# EAGLE design learning_zumo (EAGLE 9.6.1)
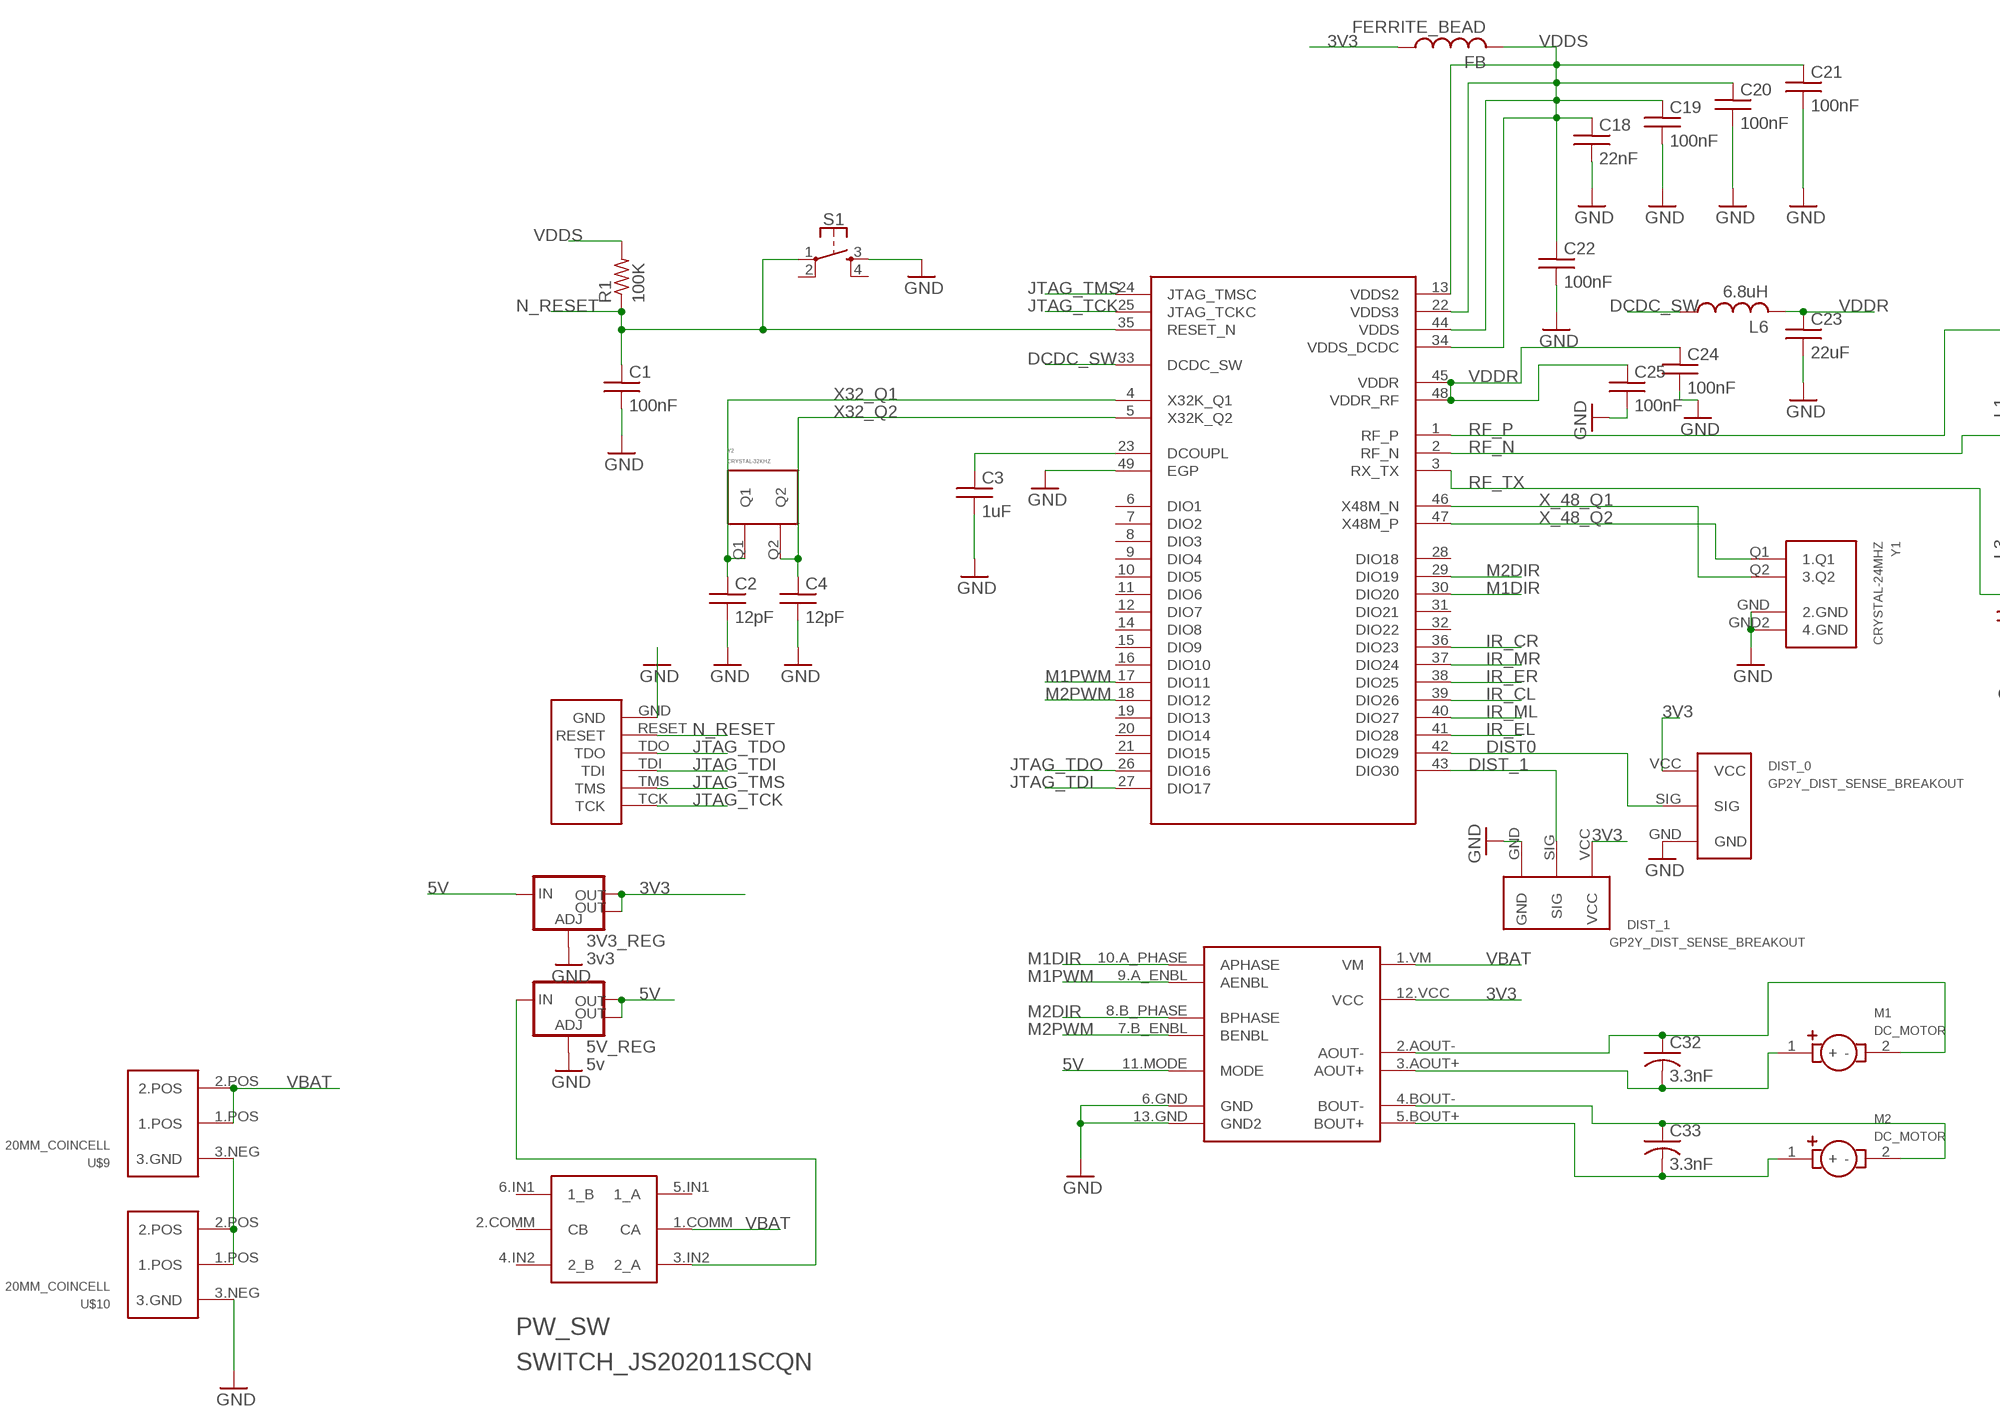
[diagram p0: schematic, sheet 1, part 1 of 2]
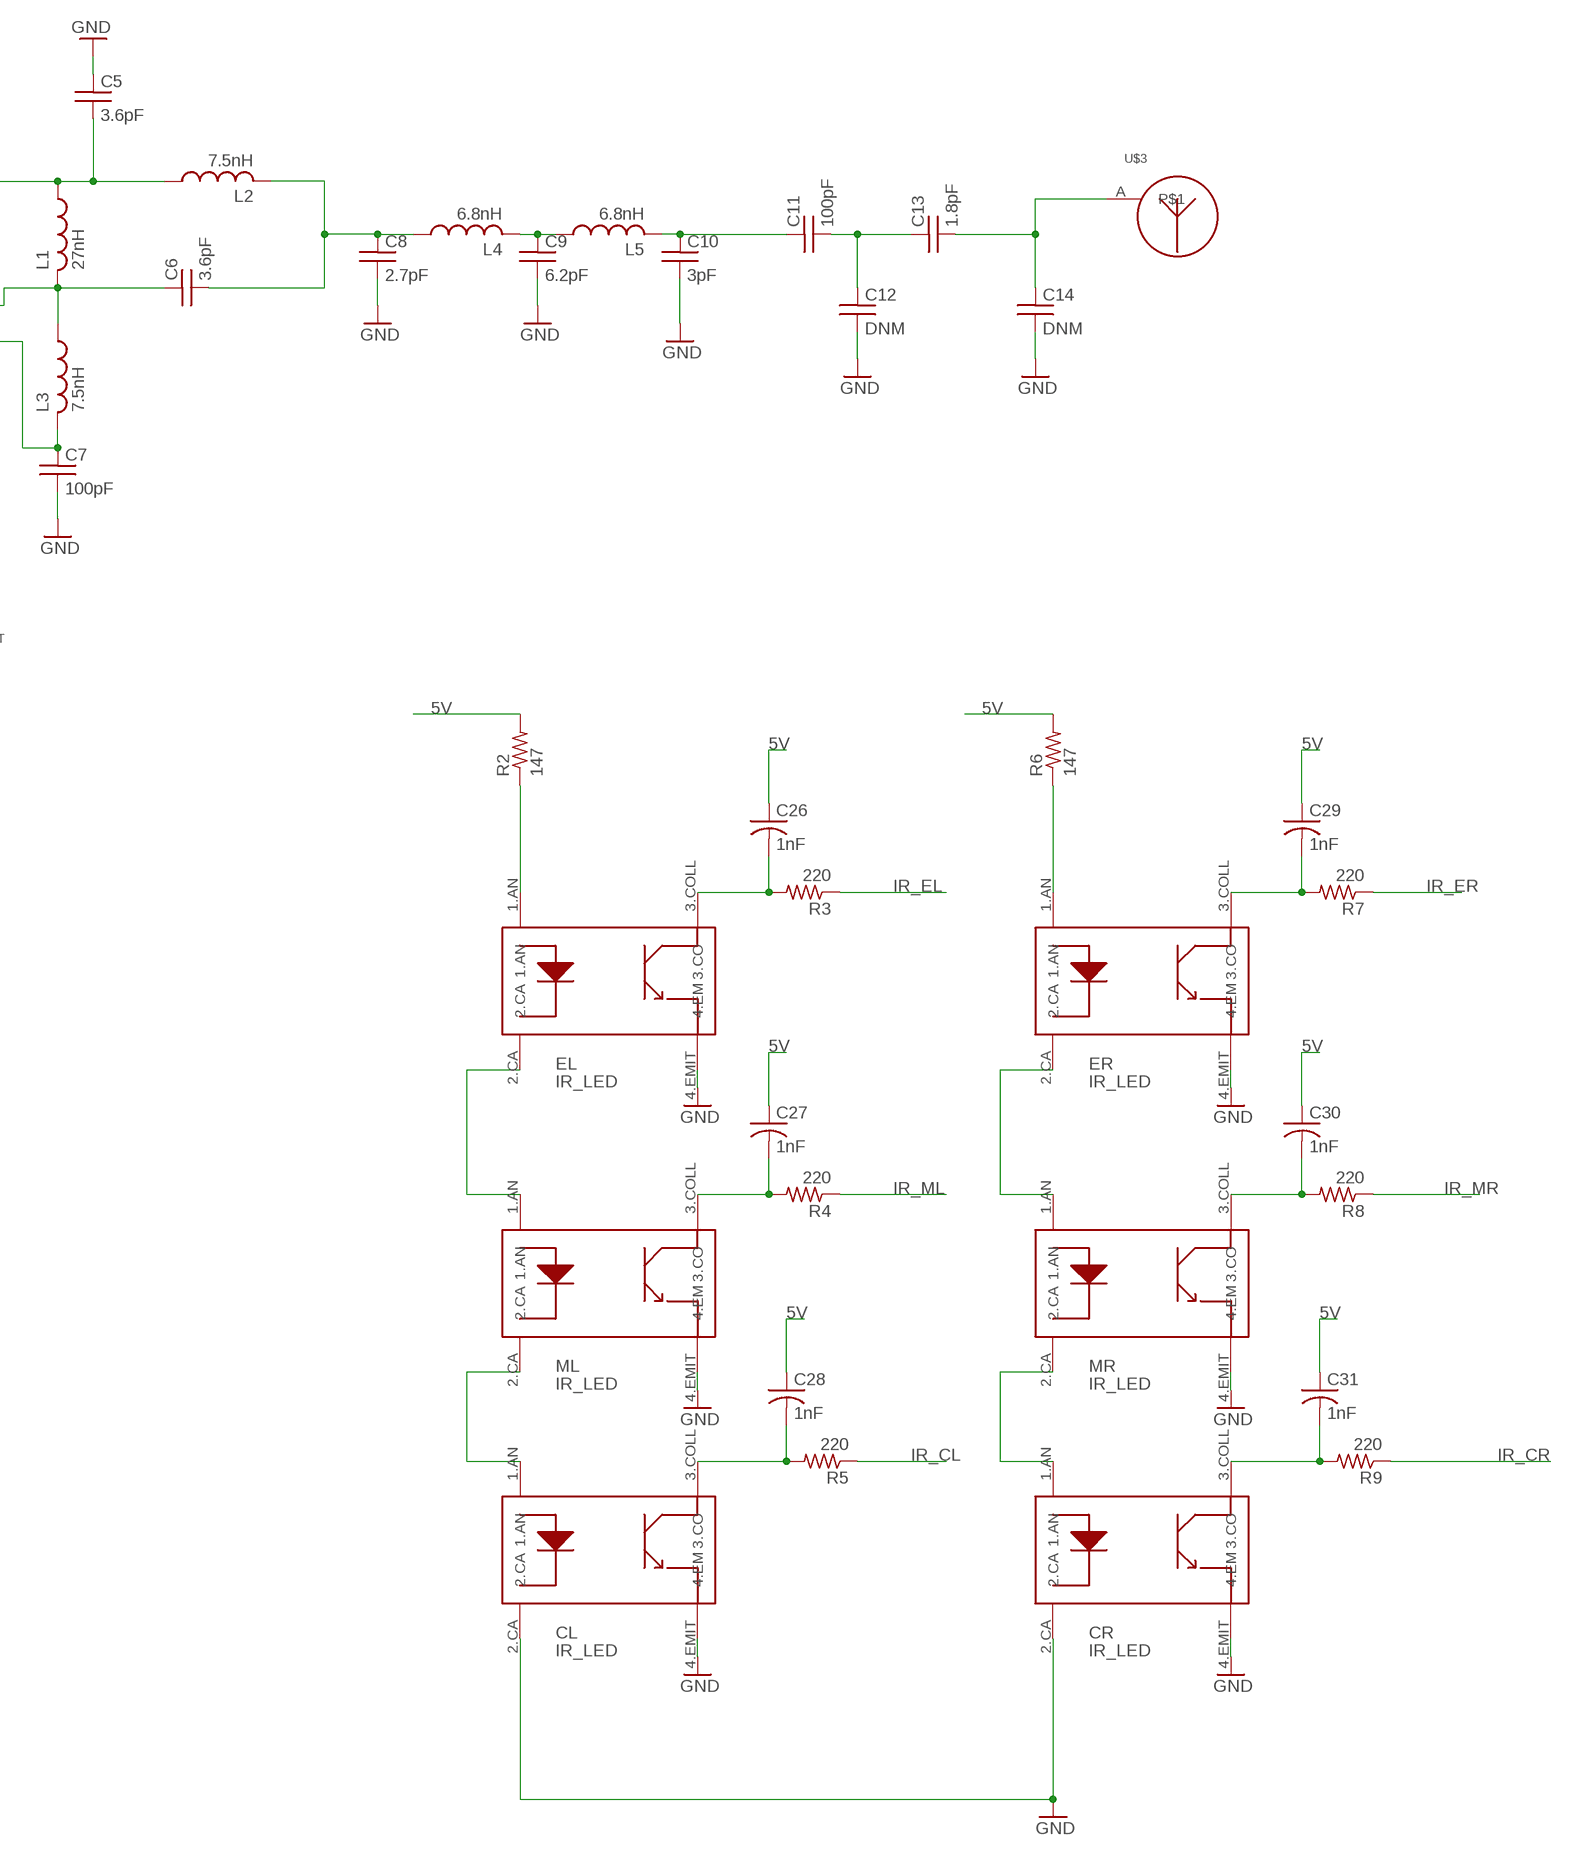
[diagram p1: schematic, sheet 1, part 2 of 2]

## Parts
3V3_REG  3v3  NU32V7_V_REG_LM1117SOT223  [NU32V7_SOT223]
5V_REG  5v  NU32V7_V_REG_LM1117SOT223  [NU32V7_SOT223]
C1  100nF  C-US  [C0402_US]
C2  12pF  C-US  [C0402_US]
C3  1uF  C-US  [C0402_US]
C4  12pF  C-US  [C0402_US]
C5  3.6pF  C-US  [C0402_US]
C6  3.6pF  C-US  [C0402_US]
C7  100pF  C-US  [C0402_US]
C8  2.7pF  C-US  [C0402_US]
C9  6.2pF  C-US  [C0402_US]
C10  3pF  C-US  [C0402_US]
C11  100pF  C-US  [C0402_US]
C12  DNM  C-US  [C0402_US]
C13  1.8pF  C-US  [C0402_US]
C14  DNM  C-US  [C0402_US]
C18  22nF  C-US  [C0402_US]
C19  100nF  C-US  [C0402_US]
C20  100nF  C-US  [C0402_US]
C21  100nF  C-US  [C0402_US]
C22  100nF  C-US  [C0402_US]
C23  22uF  C-US  [C0402_US]
C24  100nF  C-US  [C0402_US]
C25  100nF  C-US  [C0402_US]
C26  1nF  C-USC0805  [C0805]
C27  1nF  C-USC0805  [C0805]
C28  1nF  C-USC0805  [C0805]
C29  1nF  C-USC0805  [C0805]
C30  1nF  C-USC0805  [C0805]
C31  1nF  C-USC0805  [C0805]
C32  3.3nF  C-USC0805  [C0805]
C33  3.3nF  C-USC0805  [C0805]
CL  IR_LED  [IR_LED]
CR  IR_LED  [IR_LED]
DEBUG_HEADER  DEBUG_BREAKOUT  [DEBUG_BREAKOUT]
DIST_0  GP2Y_DIST_SENSE_BREAKOUT  [1X03]
DIST_1  GP2Y_DIST_SENSE_BREAKOUT  [1X03]
DRV8835  DRV8835DRV8835  [DRV8835]
EL  IR_LED  [IR_LED]
ER  IR_LED  [IR_LED]
FB  FERRITE_BEAD  [FERRITE_BEAD]
L1  27nH  L-US  [L0402_US]
L2  7.5nH  L-US  [L0402_US]
L3  7.5nH  L-US  [L0402_US]
L4  6.8nH  L-US  [L0402_US]
L5  6.8nH  L-US  [L0402_US]
L6  6.8uH  L-USL0805  [R0805]
M1  DC_MOTOR  [1X02]
M2  DC_MOTOR  [1X02]
ML  IR_LED  [IR_LED]
MR  IR_LED  [IR_LED]
PW_SW  SWITCH_JS202011SCQN  [SWITCH_JS202011SCQN]
R1  100K  R-US"  [R0402_US]
R2  147  R-US_R0805  [R0805]
R3  220  R-US_R0805  [R0805]
R4  220  R-US_R0805  [R0805]
R5  220  R-US_R0805  [R0805]
R6  147  R-US_R0805  [R0805]
R7  220  R-US_R0805  [R0805]
R8  220  R-US_R0805  [R0805]
R9  220  R-US_R0805  [R0805]
S1  MOMENTARY-SWITCH-SPST-2-SMD-4.6X2.8MM  [TACTILE_SWITCH_SMD_4.6X2.8MM]
U$1  CC1310  [QFN50P700X700X100-49N]
U$3  ANTENNA  [ANTENNA]
U$9  20MM_COINCELL  [20MM_COINCELL]
U$10  20MM_COINCELL  [20MM_COINCELL]
Y1  CRYSTAL-24MHZ  [CRYSTAL-24MHZ]
Y2  CRYSTAL-32KHZ  [CRYSTAL-32KHZ]

## Nets
3V3: 3V3_REG.OUTPUT(OUT) 3V3_REG.VOUT(OUT) DIST_0.VCC DIST_1.VCC DRV8835.12.VCC(VCC) FB.P$1
5V: 3V3_REG.INPUT(IN) 5V_REG.OUTPUT(OUT) 5V_REG.VOUT(OUT) C26.1 C27.1 C28.1 C29.1 C30.1 C31.1 DRV8835.11.MODE(MODE) R2.2 R6.2
DCDC_SW: L6.1 U$1.33(DCDC_SW)
DIST0: DIST_0.SIG U$1.42(DIO29)
DIST_1: DIST_1.SIG U$1.43(DIO30)
GND: 3V3_REG.GND(ADJ) 5V_REG.GND(ADJ) C1.2 C2.2 C3.2 C4.2 C5.1 C7.2 C8.2 C9.2 C10.2 C12.2 C14.2 C18.2 C19.2 C20.2 C21.2 C22.2 C23.2 C24.2 C25.2 CL.2.CA CL.4.EMIT(4.EM) CR.2.CA CR.4.EMIT(4.EM) DEBUG_HEADER.GND DIST_0.GND DIST_1.GND DRV8835.6.GND(GND) DRV8835.13.GND(GND2) EL.4.EMIT(4.EM) ER.4.EMIT(4.EM) ML.4.EMIT(4.EM) MR.4.EMIT(4.EM) S1.3 U$1.49(EGP) U$10.3.NEG(3.GND) Y1.GND2(4.GND) Y1.GND(2.GND)
IR_CL: R5.1 U$1.39(DIO26)
IR_CR: R9.1 U$1.36(DIO23)
IR_EL: R3.1 U$1.41(DIO28)
IR_ER: R7.1 U$1.38(DIO25)
IR_ML: R4.1 U$1.40(DIO27)
IR_MR: R8.1 U$1.37(DIO24)
JTAG_TCK: DEBUG_HEADER.TCK U$1.25(JTAG_TCKC)
JTAG_TDI: DEBUG_HEADER.TDI U$1.27(DIO17)
JTAG_TDO: DEBUG_HEADER.TDO U$1.26(DIO16)
JTAG_TMS: DEBUG_HEADER.TMS U$1.24(JTAG_TMSC)
M1DIR: DRV8835.10.A_PHASE(APHASE) U$1.30(DIO20)
M1PWM: DRV8835.9.A_ENBL(AENBL) U$1.17(DIO11)
M2DIR: DRV8835.8.B_PHASE(BPHASE) U$1.29(DIO19)
M2PWM: DRV8835.7.B_ENBL(BENBL) U$1.18(DIO12)
N$1: C3.1 U$1.23(DCOUPL)
N$2: C9.1 L4.P$2 L5.P$1
N$3: C10.1 C11.1 L5.P$2
N$4: 5V_REG.INPUT(IN) PW_SW.3.IN2(2_A)
N$5: U$9.3.NEG(3.GND) U$10.1.POS U$10.2.POS
N$6: C11.2 C12.1 C13.1
N$7: C13.2 C14.1 U$3.A
N$12: C6.2 C8.1 L2.P$2 L4.P$1
N$17: ER.1.AN R6.1
N$18: EL.1.AN R2.1
N$19: C26.2 EL.3.COLL(3.CO) R3.2
N$20: EL.2.CA ML.1.AN
N$21: CL.1.AN ML.2.CA
N$23: C27.2 ML.3.COLL(3.CO) R4.2
N$24: C33.2 DRV8835.5.BOUT+(BOUT+) M2.1(+)
N$25: C33.1 DRV8835.4.BOUT-(BOUT-) M2.2(-)
N$26: C32.2 DRV8835.3.AOUT+(AOUT+) M1.1(+)
N$27: C32.1 DRV8835.2.AOUT-(AOUT-) M1.2(-)
N$28: C28.2 CL.3.COLL(3.CO) R5.2
N$29: C29.2 ER.3.COLL(3.CO) R7.2
N$30: ER.2.CA MR.1.AN
N$31: CR.1.AN MR.2.CA
N$33: C30.2 MR.3.COLL(3.CO) R8.2
N$34: C31.2 CR.3.COLL(3.CO) R9.2
N_RESET: C1.1 DEBUG_HEADER.RESET R1.P$1 S1.1 U$1.35(RESET_N)
RF_N: C6.1 L1.P$2 L3.P$1 U$1.2(RF_N)
RF_P: C5.2 L1.P$1 L2.P$1 U$1.1(RF_P)
RF_TX: C7.1 L3.P$2 U$1.3(RX_TX)
VBAT: DRV8835.1.VM(VM) PW_SW.1.COMM(CA) U$9.1.POS U$9.2.POS
VDDR: C23.1 C24.1 C25.1 L6.2 U$1.45(VDDR) U$1.48(VDDR_RF)
VDDS: C18.1 C19.1 C20.1 C21.1 C22.1 FB.P$2 R1.P$2 U$1.13(VDDS2) U$1.22(VDDS3) U$1.34(VDDS_DCDC) U$1.44(VDDS)
X32_Q1: C2.1 U$1.4(X32K_Q1) Y2.Q1
X32_Q2: C4.1 U$1.5(X32K_Q2) Y2.Q2
X_48_Q1: U$1.46(X48M_N) Y1.Q2(3.Q2)
X_48_Q2: U$1.47(X48M_P) Y1.Q1(1.Q1)
Unconnected: PW_SW.2.COMM(CB) PW_SW.4.IN2(2_B) PW_SW.5.IN1(1_A) PW_SW.6.IN1(1_B) S1.2 S1.4 U$1.6(DIO1) U$1.7(DIO2) U$1.8(DIO3) U$1.9(DIO4) U$1.10(DIO5) U$1.11(DIO6) U$1.12(DIO7) U$1.14(DIO8) U$1.15(DIO9) U$1.16(DIO10) U$1.19(DIO13) U$1.20(DIO14) U$1.21(DIO15) U$1.28(DIO18) U$1.31(DIO21) U$1.32(DIO22)

## Library data of the parts
3V3_REG 5V_REG = Swarm:NU32V7_V_REG_LM1117: Voltage Regulator LM1117 Standard adjustable voltage regulator but in SMD form. Spark Fun Electronics SKU : COM-00595; PROD_ID: VREG-08170
C1-C14 C18-C25 = learning_particle:C-US
C26-C33 = Swarm:C-US: CAPACITOR, American symbol; SPICEPREFIX: C
CL CR EL ER ML MR = Swarm:IR_LED
DEBUG_HEADER = CC1310F128RGZ:DEBUG_BREAKOUT
DIST_0 DIST_1 = learning_particle:GP2Y_DIST_SENSE_BREAKOUT
DRV8835 = learning_particle:DRV8835
FB = CC1310F128RGZ:FERRITE_BEAD
L1-L6 = learning_particle:L-US
M1 M2 = learning_particle:DC_MOTOR
PW_SW = Swarm:SWITCH_JS202011SCQN
R1 = learning_particle:R-US
R2-R9 = Swarm:R-US_: RESISTOR, American symbol; SPICEPREFIX: R
S1 = Swarm:MOMENTARY-SWITCH-SPST-2: Momentary Switch (Pushbutton) - SPST - Two Circuits Normally-open (NO) SPST momentary switches (buttons, pushbuttons). Schematic symbol includes two switch circuits. Variants SMD-4.6MMX2.8MM - 4.60mm x 2.80mm Tactile Momentary Button Switch - Used on SparkFun SAMD21 Mini Breakout <https://www.sparkfun.com/products/13664> SMD-5.2MM - Mini Pushbutton Switch - SMD <https://www.sparkfun.com/products/8720> - Used on Arduino Pro Mini <https://www.sparkfun.com/products/11114>; PROD_ID: SWCH-13065
U$1 = learning_particle:CC1310
U$3 = learning_particle:ANTENNA
U$9 U$10 = learning_particle:20MM_COINCELL
Y1 = learning_particle:CRYSTAL-24MHZ
Y2 = learning_particle:CRYSTAL-32KHZ

## Board
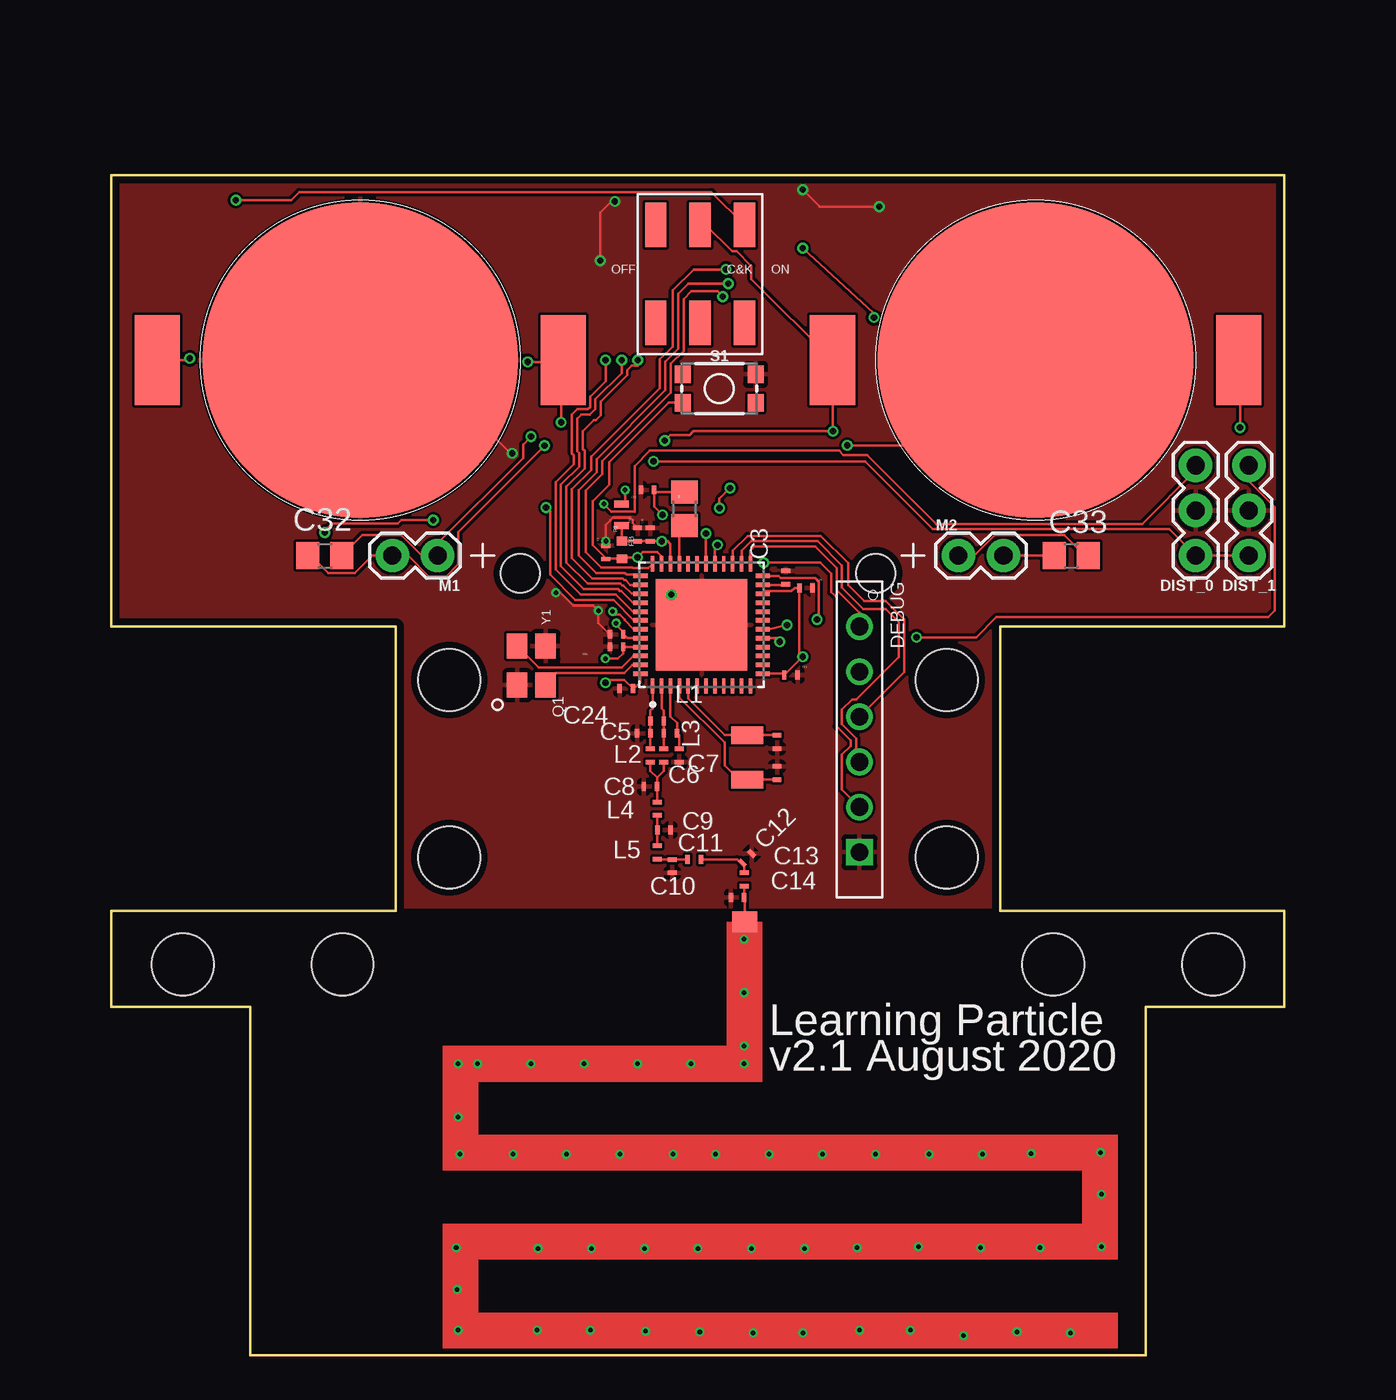
[diagram p2: board, top side]
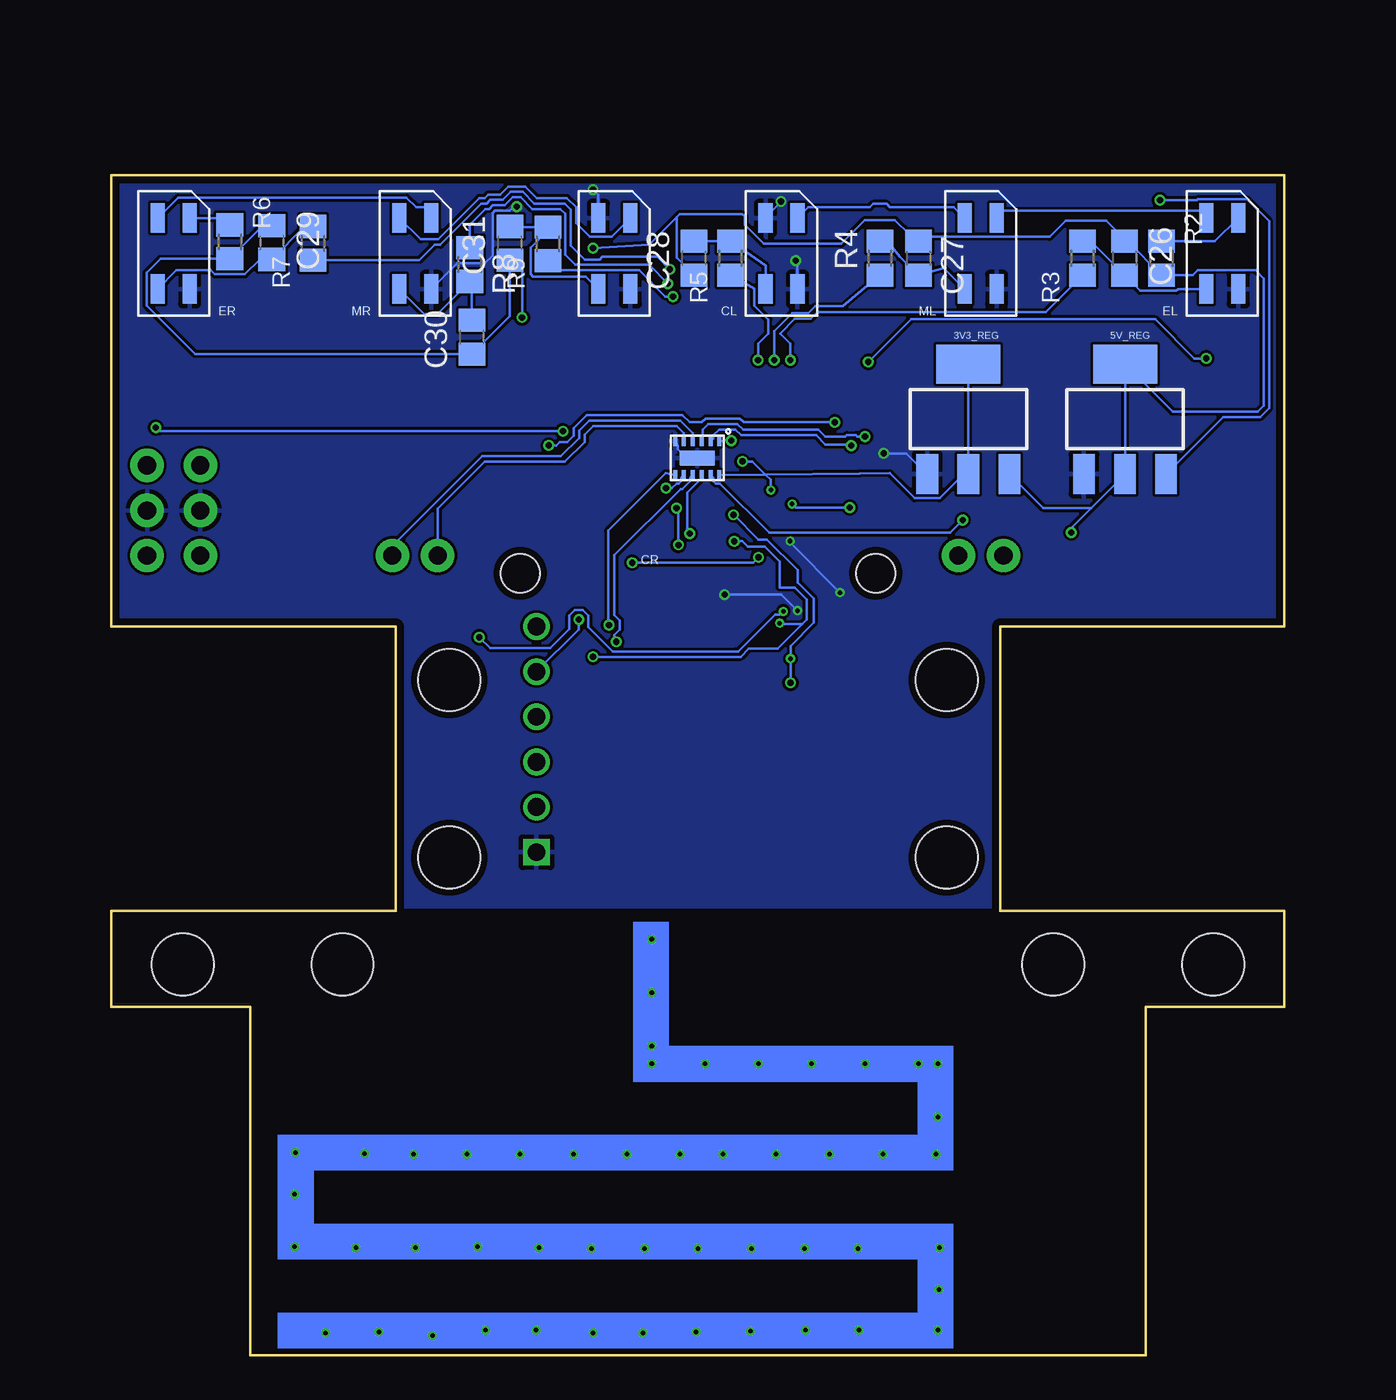
[diagram p3: board, bottom side, seen from below]

Size 66 x 66.4 mm. Coordinates in mm from the lower left corner, seen from the top.
Outline: 7.8,0 58.2,0 58.2,19.6 66,19.6 66,25 50,25 50,41 66,41 66,66.4 0,66.4 0,41 16,41 16,25 0,25 0,19.6 7.8,19.6 7.8,0
Copper layers (1*16): Top 0.035559375mm / dielectric 1.6mm / Bottom 0.035559375mm
Design rules "oshpark-2layer *": minimum track width 6mil, minimum drill 10mil, track to track 6mil, track to pad 6mil, pad to pad 6mil, via to via 6mil, smd to smd 0mil, copper to edge 15mil, drill to drill 6mil, minimum pad ring 5mil, minimum via ring 5mil, stop-mask expansion 2.5mil, vias tented up to drill 10mil, thermal gap 10mil
Holes 3.5 mm at 19,38 19,28 47,38 47,28 13,22 4,22 53,22 62,22
Holes 2.2 mm at 23,44 43,44

### Footprints (pad centres in the part's own frame; a part is rotated, then mirrored left to right if it is on the bottom)
NU32V7_SOT223 = smd 1.219 x 2.235: GND -2.311,-3.099; INPUT 2.311,-3.099; OUTPUT 0,-3.099 | smd 3.6 x 2.2: VOUT 0,3.099
C0402_US = smd 0.25 x 0.5: 1 -0.375,0; 2 0.375,0
C0805 = smd 1.3 x 1.5: 1 -0.95,0; 2 0.95,0
IR_LED = smd 0.79 x 1.66: 1.AN -0.9,-2; 2.CA 0.9,-2; 3.COLL 0.9,2; 4.EMIT -0.9,2
DEBUG_BREAKOUT = drill 1 square: GND 12.7,0 | drill 1: RESET 10.16,0; TCK 0,0; TDI 5.08,0; TDO 7.62,0; TMS 2.54,0
1X03 = drill 1.016 pad 1.88: GND 2.54,0; SIG 5.08,0; VCC 0,0
DRV8835 = smd 0.5 x 0.25: 1.VM -0.95,1.25; 2.AOUT- -0.95,0.75; 3.AOUT+ -0.95,0.25; 4.BOUT- -0.95,-0.25; 5.BOUT+ -0.95,-0.75; 6.GND -0.95,-1.25; 7.B_ENBL 0.95,-1.25; 8.B_PHASE 0.95,-0.75; 9.A_ENBL 0.95,-0.25; 10.A_PHASE 0.95,0.25; 11.MODE 0.95,0.75; 12.VCC 0.95,1.25 | smd 0.9 x 2: 13.GND 0,0
FERRITE_BEAD = smd 0.4 x 0.8: P$1 -0.6,0; P$2 0.6,0
L0402_US = smd 0.25 x 0.5: P$1 -0.375,0; P$2 0.375,0
R0805 = smd 1.3 x 1.5: 1 -0.95,0; 2 0.95,0
1X02 = drill 1.016 pad 1.88: 1 0,0; 2 2.54,0
SWITCH_JS202011SCQN = smd 1.2 x 2.5: 1.COMM 0,2.75; 2.COMM 0,-2.75; 3.IN2 2.5,2.75; 4.IN2 2.5,-2.75; 5.IN1 -2.5,2.75; 6.IN1 -2.5,-2.75
R0402_US = smd 0.5 x 0.6: P$1 -0.5,0; P$2 0.5,0
TACTILE_SWITCH_SMD_4.6X2.8MM = smd 0.9 x 1: 1 -2.05,-0.8; 2 2.05,-0.8; 3 2.05,0.8; 4 -2.05,0.8
QFN50P700X700X100-49N = smd 0.86 x 0.26: 1 -3.435,2.75; 2 -3.435,2.25; 3 -3.435,1.75; 4 -3.435,1.25; 5 -3.435,0.75; 6 -3.435,0.25; 7 -3.435,-0.25; 8 -3.435,-0.75; 9 -3.435,-1.25; 10 -3.435,-1.75; 11 -3.435,-2.25; 12 -3.435,-2.75; 25 3.435,-2.75; 26 3.435,-2.25; 27 3.435,-1.75; 28 3.435,-1.25; 29 3.435,-0.75; 30 3.435,-0.25; 31 3.435,0.25; 32 3.435,0.75; 33 3.435,1.25; 34 3.435,1.75; 35 3.435,2.25; 36 3.435,2.75 | smd 0.26 x 0.86: 13 -2.75,-3.435; 14 -2.25,-3.435; 15 -1.75,-3.435; 16 -1.25,-3.435; 17 -0.75,-3.435; 18 -0.25,-3.435; 19 0.25,-3.435; 20 0.75,-3.435; 21 1.25,-3.435; 22 1.75,-3.435; 23 2.25,-3.435; 24 2.75,-3.435; 37 2.75,3.435; 38 2.25,3.435; 39 1.75,3.435; 40 1.25,3.435; 41 0.75,3.435; 42 0.25,3.435; 43 -0.25,3.435; 44 -0.75,3.435; 45 -1.25,3.435; 46 -1.75,3.435; 47 -2.25,3.435; 48 -2.75,3.435 | smd 5.15 x 5.15: 49 0,0
ANTENNA = smd 1.4 x 1.15: A 1,1
20MM_COINCELL = smd 2.54 x 5.08: 1.POS -11.43,0; 2.POS 11.43,0 | smd 17.78 x 17.78: 3.NEG 0,0
CRYSTAL-24MHZ = smd 1.4 x 1.15: GND -1.1,1.1; GND2 1.1,-0.5; Q1 -1.1,-0.5; Q2 1.1,1.1
CRYSTAL-32KHZ = smd 1 x 1.8: Q1 1.25,0; Q2 -1.25,0

### Placement (x,y rotation side)
3V3_REG  17.79,52.68 0 bottom
5V_REG  8.97,52.68 0 bottom
C1  27.82,45.18 90 top
C2  37.45,32.77 90 top
C3  37.95,43.76 90 top
C4  37.45,34.51 270 top
C5  29.95,35 0 top
C6  31.07,33.75 270 top
C7  31.95,33.75 270 top
C8  30.32,32 180 top
C9  31.09,29.55 0 top
C10  31.55,27.52 270 top
C11  32.79,27.89 0 top
C12  35.76,27.97 45 top
C13  35.6,26.77 270 top
C14  35.23,25.75 180 top
C18  29.6,46.19 90 top
C19  28.42,40.57 180 top
C20  39.08,43.18 0 top
C21  38.23,38.28 0 top
C22  30.32,46.18 90 top
C23  30.16,48.7 180 top
C24  28.97,37.52 180 top
C25  28.42,39.87 180 top
C26  9,61.74 270 bottom
C27  20.6,61.74 270 bottom
C28  33.22,61.74 90 bottom
C29  56.98,62.62 270 bottom
C30  45.72,57.3 90 bottom
C31  43.58,62.58 90 bottom
C32  12,45 0 top
C33  54,45 0 top
CL  28.3,62 180 bottom
CR  37.7,62 180 bottom
DEBUG_HEADER  42.09,41.01 270 top
DIST_0  61,45 90 top
DIST_1  64,45 90 top
DRV8835  33.04,50.49 270 bottom
EL  3.5,62 180 bottom
ER  62.5,62 180 bottom
FB  28.7,47.3 270 top
L1  30.7,35.7 0 top
L2  30.32,33.75 270 top
L3  31.45,35 0 top
L4  30.7,30.75 270 top
L5  30.7,28.28 270 top
L6  32.25,47.63 90 top
M1  18.35,45 180 top
M2  47.65,45 0 top
ML  17.1,62 180 bottom
MR  48.9,62 180 bottom
PW_SW  33.12,60.85 0 top
R1  28.72,45.32 90 top
R2  6.92,61.74 270 bottom
R3  11.36,61.74 90 bottom
R4  22.76,61.74 90 bottom
R5  31.16,61.74 90 bottom
R6  59.34,62.66 270 bottom
R7  54.66,62.58 90 bottom
R8  45.84,61.38 270 bottom
R9  41.44,62.54 90 bottom
S1  34.2,54.4 0 top
U$1  33.2,41.1 90 top
U$3  36.63,25.39 180 top
U$9  52,56 180 top
U$10  14,56 0 top
Y1  23.93,38.81 90 top
Y2  35.76,33.64 270 top

### Tracks (layer width: path | path; a pad name or v marks a point on that pad's centre or on a via)
3V3  (via drill 0.25, 0.35)
  Top 0.152: v28.9,48.7 28.9,48.1 FB.P$1 | v30.5,50.3 42.4,50.3 46.22,46.48 59.52,46.48 DIST_0.VCC DIST_1.VCC
  Bottom 0.152: 3V3_REG.VOUT 3V3_REG.OUTPUT 18.05,49.58 19.4,48.23 20.81,48.23 22.21,49.64 23.9,49.62 29.2,49.57 | DRV8835.12.VCC 29.2,49.57 | 29.2,49.57 29.93,50.3 v30.5,50.3 | v28.9,48.7 28.9,49.27 29.2,49.57
5V  (via drill 0.35)
  Top 0.152: v18.1,47 16.3,47 16.1,46.8 12.4,46.8 12,46.4 v12,46.3 | v38.9,62.3 42.88,58.63 v42.9,58.4
  Bottom 0.152: 10.88,47.68 5V_REG.OUTPUT 5V_REG.VOUT 6.29,53.1 1.5,53.1 1.17,53.43 1.17,60.6 1.63,61.06 4.89,61.06 5.16,60.79 R2.2 8.82,62.69 C26.1 9,62.83 10.02,63.85 12.3,63.85 13.21,62.94 20.46,62.94 C27.1 21.11,63.08 21.91,63.89 23.61,63.89 24.95,62.55 29.3,62.55 30.38,63.63 30.38,64.09 30.52,64.23 34.02,64.23 34.2,64.06 | 10.88,47.68 12,46.55 v12,46.3 | v18.1,47 18.8,46.3 29,46.3 31.76,49.06 32,49.06 32.14,49.2 32.14,49.39 DRV8835.11.MODE | 34.2,64.06 34.2,61.77 C28.1 | v38.9,62.3 35.75,62.5 34.2,64.06 | v42.9,58.4 42.9,60.95 C31.1 43.58,58.49 C30.1 61.3,56.35 64.02,59.08 64.02,60.92 63.24,61.71 R6.2 57.48,63.57 C29.1 | 3V3_REG.INPUT 13.57,47.68 10.88,47.68
DCDC_SW
  Top 0.152: U$1.33 31.95,46.38 L6.1
DIST0  (via drill 0.25, 0.35)
  Top 0.152: U$1.42 29.4,41.35 28.25,42.5 26.1,42.5 24.68,43.92 24.68,47.47 v24.45,47.7 | v27.7,47.9 28.13,47.47 29.43,47.47 29.43,50.05 30.29,50.9 40.95,50.9 41.18,50.67 42.53,50.67 46.41,46.79 57.99,46.79 61,49.8 DIST_0.SIG
  Bottom 0.152: v24.45,47.7 27.5,47.7 v27.7,47.9
DIST_1  (via drill 0.25, 0.35)
  Top 0.152: DIST_1.SIG 64,49.19 65.47,47.73 65.47,41.9 65.1,41.53 49.78,41.53 48.65,40.4 v45.3,40.4 | v28.2,41.86 28.38,41.68 28.6,41.68 28.88,41.4 28.88,41.37 29.4,40.85 U$1.43
  Bottom 0.152: v45.3,40.4 44.7,39.8 41.3,39.8 40.23,40.87 40.23,41.62 39.92,41.93 39.48,41.93 39.17,41.62 39.17,40.97 37.8,39.6 30.9,39.6 30.8,39.6 30.73,39.6 28.65,41.68 28.38,41.68 v28.2,41.86
GND  (via drill 0.25, 0.35)
  Top 0.152: U$10.3.NEG 17.2,56 22.5,50.7 v22.55,50.75 | U$1.49 v31.5,42.8 | C19.2 27.4,41.22 v27.4,41.9 27.11,42.2 25.97,42.2 25.26,42.91 v25.01,42.91 | v27.5,61.6 27.5,64.3 28.3,65.1 28.33,65.07 v28.33,64.93 | v43.2,64.63 39.87,64.63 v38.9,65.6 | C1.2 v27.82,45.82 27.82,46.72 28.07,46.97 28.07,46.99 28.2,47.13 29.2,47.13 29.33,46.99 29.33,46.84 C18.2
  Bottom 0.152: v22.55,50.75 21.27,50.75 3V3_REG.GND | DRV8835.6.GND 34.14,51.19 34.14,51 33.63,50.49 DRV8835.13.GND | v31.5,42.8 28.3,42.8 v27.4,41.9 | CL.4.EMIT 27.4,61.5 v27.5,61.6 | v28.33,64.93 29.2,64.06 CL.2.CA | v43.2,64.63 43.37,64.63 43.59,64.41 44.42,64.41 44.56,64.28 44.56,61.89 44.99,61.45 46.55,61.45 MR.4.EMIT | v38.9,65.6 38.6,65.3 CR.2.CA | v25.01,42.91 27.82,45.72 v27.82,45.82
  pour Top: 0,25.2 66.06,25.2 67.1,26.24 67.1,66.1 65.6,67.6 0.8,67.6 -1.9,64.9 -1.9,27.1
  pour Bottom: 0.2,25.2 -0.25,25.65 -0.25,25.55 -1.9,27.2 -1.9,66 -0.1,67.8 66.5,67.8 66.8,67.5 66.8,25.8 66.2,25.2
IR_CL  (via drill 0.35)
  Top 0.152: v29.62,56 29.62,55.72 29.6,55.7 29.27,55.7 29.01,55.45 29.01,55.15 27.54,53.67 27.54,52.91 27.25,52.62 27.14,52.62 26.52,52 26.52,51 26.62,50.9 26.62,49.9 25.59,48.88 25.59,44.62 26.8,43.41 28.63,43.41 28.73,43.32 28.8,43.32 29.27,42.85 U$1.39
  Bottom 0.152: v29.62,56 29.62,56.92 29.04,57.5 29.04,58.29 29.82,59.08 29.82,60.03 R5.1
IR_CR  (via drill 0.35)
  Top 0.152: v34.4,59.58 34.1,59.88 32.62,59.88 32.19,59.45 32.19,56.52 31.47,55.8 31.47,54.18 27.61,50.32 27.61,49.57 26.7,48.67 26.7,45.2 27.57,44.33 29.31,44.33 29.35,44.29 30.21,44.29 U$1.36
  Bottom 0.152: v34.4,59.58 34.83,59.58 36.31,61.06 40.91,61.06 R9.1
IR_EL  (via drill 0.35)
  Top 0.152: v27.8,56 27.8,54.83 26.93,53.96 26.93,53.37 26.8,53.23 26.2,53.23 25.91,52.94 25.91,50.75 26.01,50.65 26.01,50.15 24.99,49.13 24.99,44.22 26.4,42.8 28.38,42.8 29.33,41.85 U$1.41
  Bottom 0.152: v27.8,56 27.8,56.92 28.38,57.5 27.55,58.33 26.66,58.33 26.29,58.7 13.43,58.7 R3.1
IR_ER  (via drill 0.35)
  Top 0.152: U$1.38 29.2,43.35 28.93,43.62 28.85,43.62 28.75,43.72 27.05,43.72 25.9,44.87 25.9,48.73 27,49.83 27,50.57 30.86,54.44 30.86,56.05 31.58,56.77 31.58,59.93 32.76,61.1 v34.58,61.1
  Bottom 0.152: R7.1 48.67,61.63 47.8,62.49 47.5,62.49 45.18,64.81 44.88,64.81 44.68,65.02 44,65.02 43.55,65.47 42.85,65.47 42.2,64.81 40.51,64.81 40.16,64.46 40.16,62.46 39.37,61.67 38.53,61.67 38.38,61.82 35.3,61.82 v34.58,61.1
IR_ML  (via drill 0.35)
  Top 0.152: v28.71,56 28.71,55.27 27.23,53.8 27.23,53.24 26.92,52.93 26.44,52.93 26.21,52.7 26.21,50.88 26.31,50.78 26.31,50.02 25.29,49 25.29,44.4 26.58,43.11 28.5,43.11 28.6,43.01 28.68,43.01 29.34,42.35 U$1.40
  Bottom 0.152: v28.71,56 28.71,57.64 27.71,58.64 26.78,58.64 26.39,59.03 24.84,59.03 R4.1
IR_MR  (via drill 0.35)
  Top 0.152: U$1.37 29.69,43.93 28.98,43.93 28.88,44.02 27.28,44.02 26.3,45 26.3,48.7 27.3,49.7 27.3,50.44 31.17,54.31 31.17,55.92 31.89,56.64 31.89,59.74 32.46,60.31 v34.7,60.31
  Bottom 0.152: R8.1 45.84,63.63 44.96,64.51 44.76,64.51 44.55,64.71 43.87,64.71 43.42,65.17 42.98,65.17 42.32,64.51 40.73,64.51 40.46,64.23 40.46,61.92 39.9,61.36 35.75,61.36 v34.7,60.31
JTAG_TCK
  Top 0.152: U$1.25 35.95,45.27 36.18,45.5 39.6,45.5 40.8,44.3 40.8,43.07 42.09,41.78 DEBUG_HEADER.TCK
JTAG_TDI
  Top 0.152: U$1.27 34.95,45.27 35.79,46.11 39.9,46.11 41.44,44.57 41.44,43.35 42.35,42.44 43.57,42.44 44.61,41.4 44.61,38.45 DEBUG_HEADER.TDI
JTAG_TDO
  Top 0.152: U$1.26 35.45,45.27 35.98,45.8 39.73,45.8 41.1,44.43 41.1,43.2 42.3,42 43.58,42 44.3,41.27 44.3,39.3 41.92,36.91 41.68,36.91 41.1,36.33 41.1,35.52 41.91,34.71 41.91,34.17 41.61,33.87 DEBUG_HEADER.TDO
JTAG_TMS  (via drill 0.35)
  Top 0.152: U$1.24 37.54,43.85 37.65,43.74 39.59,43.74 39.81,43.52 39.81,41.51 v39.7,41.4
  Bottom 0.152: v39.7,41.4 39.7,40.85 DEBUG_HEADER.TMS
M1DIR  (via drill 0.35)
  Top 0.152: v33.46,46.24 v33.45,46.23 U$1.30
  Bottom 0.152: v33.46,46.24 33.6,46.38 33.6,48.54 32.79,49.35 DRV8835.10.A_PHASE
M1PWM  (via drill 0.35)
  Top 0.152: U$1.17 37.39,40.35 v37.6,40.15
  Bottom 0.152: v37.6,40.15 37.71,40.26 37.71,40.53 37.4,40.84 37.4,41.34 37.71,41.65 37.71,45.03 33.98,48.76 33.88,48.76 33.44,49.2 33.44,49.39 DRV8835.9.A_ENBL
M2DIR  (via drill 0.35)
  Top 0.152: v34.1,45.6 33.95,45.45 U$1.29 | v34.21,47.67 34.21,48.21 v34.8,48.8
  Bottom 0.152: v34.1,45.6 34.1,47.57 v34.21,47.67 | DRV8835.8.B_PHASE 33.94,49.39 33.94,49.2 34.08,49.06 34.2,49.06 34.46,48.8 v34.8,48.8
M2PWM  (via drill 0.35)
  Top 0.152: U$1.18 36.69,40.79 v38.01,41.09
  Bottom 0.152: DRV8835.7.B_ENBL 34.81,49.64 38.05,46.41 38.05,41.14 v38.01,41.09
N$1
  Top 0.152: U$1.23 37.91,43.35 C3.1
N$2
  Top 0.152: L4.P$2 30.7,29.57 C9.1 L5.P$1
N$3
  Top 0.152: L5.P$2 31.54,27.91 C10.1 C11.1
N$4  (via drill 0.35)
  Top 0.152: v7,65 10.1,65 10.56,65.46 33.76,65.46 PW_SW.3.IN2
  Bottom 0.152: 5V_REG.INPUT 3.44,52.8 1.37,52.8 0.86,53.3 0.86,63.81 2.11,65.06 4.89,65.06 4.95,65 v7,65
N$5  (via drill 0.35)
  Top 0.152: v25.3,52.5 25.3,55.2 25.43,55.33 25.43,55.8 | 25.43,55.8 U$10.2.POS | U$9.3.NEG 51.9,55.9 51.1,55.9 46.4,51.2 v41.4,51.2 | U$10.1.POS 4.4,56 v4.4,56.1 | v23.42,55.9 25.33,55.9 25.43,55.8
  Bottom 0.152: v4.4,56.1 5.07,56.1 7.28,58.31 21.01,58.31 v23.42,55.9 | v25.3,52.5 30.44,52.5 30.65,52.71 32.56,52.71 32.77,52.5 33.46,52.5 33.87,52.91 39.25,52.91 39.99,52.17 39.99,51.75 40.35,51.39 40.77,51.39 40.96,51.2 v41.4,51.2
N$6
  Top 0.152: C11.2 35.2,27.9 35.4,27.7 C12.1 35.61,27.59 C13.1
N$7
  Top 0.152: C13.2 C14.1 35.63,25.72 35.63,24.62 U$3.A
N$8  (via drill 0.25)
  other vias: 35.6,23.4
N$10  (via drill 0.25)
  other vias: 35.6,17.4
N$11  (via drill 0.25)
  other vias: 35.6,20.4
N$12
  Top 0.152: L2.P$2 30.32,32.88 30.7,32.5 | 30.7,32.5 C8.1 L4.P$1 | C6.2 31.07,32.88 30.7,32.5
N$13  (via drill 0.25)
  other vias: 23.6,16.4
N$14  (via drill 0.25)
  other vias: 35.6,16.4
N$15  (via drill 0.25)
  other vias: 32.6,16.4
N$16  (via drill 0.25)
  other vias: 29.6,16.4
N$17
  Bottom 0.152: ER.1.AN 59.73,64 R6.1
N$18
  Bottom 0.152: EL.1.AN 3.91,62.69 R2.1
N$19
  Bottom 0.152: R3.2 10.9,62.69 C26.2 8.12,59.91 6.08,59.91 5.99,60 EL.3.COLL
N$20
  Bottom 0.152: EL.2.CA 4.8,64.4 15.8,64.4 ML.1.AN
N$21
  Bottom 0.152: ML.2.CA 18.6,64.6 22.2,64.6 22.39,64.79 23.13,64.79 23.32,64.6 26.8,64.6 CL.1.AN
N$22  (via drill 0.25)
  other vias: 26.6,16.4
N$23
  Bottom 0.152: ML.3.COLL 19.18,61.18 C27.2 21.64,61.83 22.53,62.91 R4.2
N$24
  Top 0.152: M2.1 48.54,45 49.71,46.17 53.6,46.17 54.77,45 C33.2
  Bottom 0.152: DRV8835.5.BOUT+ 33.79,51.9 34.2,52.3 38.9,52.3 39.38,51.82 39.38,51.4 40.5,50.28 45,50.28 47.65,47.63 M2.1
N$25
  Top 0.152: M2.2 C33.1
  Bottom 0.152: DRV8835.4.BOUT- 33.29,51.9 34,52.6 39.13,52.6 39.69,52.04 39.69,51.62 40.72,50.59 45.13,50.59 50.19,45.52 M2.2
N$26  (via drill 0.35)
  Top 0.152: v23.6,51.7 23.16,51.26 23.16,50.5 18.35,45.69 M1.1 17.46,45 16.29,46.17 14.12,46.17 C32.2
  Bottom 0.152: DRV8835.3.AOUT+ 32.74,51.45 32.74,52.1 32.43,52.41 30.78,52.41 30.45,52.08 26.22,52.08 25.84,51.7 24.71,51.7 24.62,51.79 24.12,51.79 24.03,51.7 v23.6,51.7
N$27  (via drill 0.35)
  Top 0.152: v24.37,51.19 19.52,46.33 19.52,44.52 18.83,43.83 17.87,43.83 16.7,45 M1.2 14.67,45 13.7,44.02 12.21,44.02 11.23,45 C32.1
  Bottom 0.152: DRV8835.2.AOUT- 32.14,51.58 32.14,51.78 31.82,52.1 30.91,52.1 30.58,51.78 26.34,51.78 25.83,51.26 24.5,51.26 24.43,51.19 v24.37,51.19
N$28
  Bottom 0.152: CL.3.COLL 29.2,61.33 R5.2 C28.2
N$29
  Bottom 0.152: ER.3.COLL 62.34,61.06 60.41,61.06 60.19,60.83 58.49,60.83 57.66,61.67 C29.2 55.12,63.53 R7.2
N$30
  Bottom 0.152: ER.2.CA 62.24,65.16 49.41,65.16 48.85,64.6 48.2,64.6 48,64.4 MR.1.AN
N$31
  Bottom 0.152: CR.1.AN 37.86,62.94 39.09,62.94 39.85,63.7 39.85,64.6 40.37,65.12 42.07,65.12 42.73,65.78 43.67,65.78 44.12,65.32 44.8,65.32 45.01,65.12 45.31,65.12 47.62,62.8 48.6,62.8 MR.2.CA
N$32  (via drill 0.25)
  other vias: 49,11.3
N$33
  Bottom 0.152: C30.2 45.72,60.31 R8.2 47.67,58.6 48.4,58.6 MR.3.COLL
N$34
  Bottom 0.152: C31.2 43.54,63.49 R9.2 41.44,63.31 42.42,62.34 42.42,60.84 42.28,60.71 39.31,60.71 CR.3.COLL
N$35  (via drill 0.25)
  other vias: 20.6,16.4
N$36  (via drill 0.25)
  other vias: 19.5,16.4
N$37  (via drill 0.25)
  other vias: 19.5,13.4
N$38  (via drill 0.25)
  other vias: 19.6,11.3
N$39  (via drill 0.25)
  other vias: 22.6,11.3
N$40  (via drill 0.25)
  other vias: 25.6,11.3
N$41  (via drill 0.25)
  other vias: 28.6,11.3
N$42  (via drill 0.25)
  other vias: 51.75,11.35
N$43  (via drill 0.25)
  other vias: 55.65,11.4
N$44  (via drill 0.25)
  other vias: 55.7,9.05
N$45  (via drill 0.25)
  other vias: 55.7,6.1
N$46  (via drill 0.25)
  other vias: 52.25,6.05
N$47  (via drill 0.25)
  other vias: 48.9,6.05
N$48  (via drill 0.25)
  other vias: 45.4,6.1
N$49  (via drill 0.25)
  other vias: 41.95,6.05
N$50  (via drill 0.25)
  other vias: 39,6
N$51  (via drill 0.25)
  other vias: 36,6
N$52  (via drill 0.25)
  other vias: 33,6
N$53  (via drill 0.25)
  other vias: 30,6
N$54  (via drill 0.25)
  other vias: 27,6
N$55  (via drill 0.25)
  other vias: 24,6
N$57  (via drill 0.25)
  other vias: 19.4,6.05
N$58  (via drill 0.25)
  other vias: 19.45,3.7
N$59  (via drill 0.25)
  other vias: 19.5,1.4
N$61  (via drill 0.25)
  other vias: 23.95,1.4
N$62  (via drill 0.25)
  other vias: 26.95,1.4
N$63  (via drill 0.25)
  other vias: 30.05,1.35
N$64  (via drill 0.25)
  other vias: 33.1,1.3
N$65  (via drill 0.25)
  other vias: 36.1,1.25
N$66  (via drill 0.25)
  other vias: 38.9,1.25
N$67  (via drill 0.25)
  other vias: 42.1,1.4
N$68  (via drill 0.25)
  other vias: 44.95,1.4
N$69  (via drill 0.25)
  other vias: 47.95,1.1
N$70  (via drill 0.25)
  other vias: 50.95,1.3
N$71  (via drill 0.25)
  other vias: 53.95,1.25
N$72  (via drill 0.25)
  other vias: 31.6,11.3
N$73  (via drill 0.25)
  other vias: 37,11.3
N$74  (via drill 0.25)
  other vias: 34,11.3
N$75  (via drill 0.25)
  other vias: 40,11.3
N$76  (via drill 0.25)
  other vias: 43,11.3
N$77  (via drill 0.25)
  other vias: 46,11.3
N_RESET  (via drill 0.35)
  Top 0.152: U$1.35 30.95,44.95 30.7,45.2 29.9,45.2 v29.6,44.9 28.8,44.9 R1.P$1 27.84,44.82 C1.1 27.82,44.86 27.07,45.6 27.07,48.07 28,49 28,50.25 31.35,53.6 S1.1 | DEBUG_HEADER.RESET 41.1,31.83 41.1,33.79 41.61,34.3 41.61,34.59 40.8,35.39 40.8,42.64 40.49,42.95 40.49,43.99 39.88,44.6 v36.7,44.6
  Bottom 0.152: v36.7,44.6 29.9,44.6 v29.6,44.9
RF_N
  Top 0.152: C6.1 L3.P$1 L1.P$2 31.07,36.27 30.95,36.4 U$1.2
RF_P
  Top 0.152: L2.P$1 C5.2 L1.P$1 30.32,36.27 30.45,36.4 U$1.1
RF_TX
  Top 0.152: U$1.3 31.45,35.95 31.82,35.58 L3.P$2 31.95,34.88 C7.1
VBAT  (via drill 0.35)
  Top 0.152: v63.5,52.2 63.5,55.93 U$9.1.POS | v31.13,51.47 31.45,51.8 32.53,51.8 32.73,52 v40.6,52 40.57,52.03 U$9.2.POS 36,60.57 36,61.3 35.18,62.12 34.92,62.12 33.45,63.6 PW_SW.1.COMM
  Bottom 0.152: v40.6,52 63.3,52 v63.5,52.2 | DRV8835.1.VM 31.59,51.44 31.51,51.5 31.16,51.5 v31.13,51.47
VDDR  (via drill 0.25, 0.35)
  Top 0.152: U$1.48 29.77,37.87 29.42,37.52 C24.1 28.86,38 27.95,38 v27.79,37.84 | U$1.45 28.82,39.85 C25.1 28.8,39.49 28.5,39.2 v27.79,39.2 | v31,47.3 30.54,47.77 C23.1 30.66,48.58 L6.2
  Bottom 0.152: v31,47.3 29.61,45.91 29.12,45.91 27.39,44.18 27.39,43.48 26.49,42.58 26.49,41.22 27.79,39.92 v27.79,39.2 v27.79,37.84
VDDS  (via drill 0.25, 0.35)
  Top 0.152: v28.4,41.2 28.4,41.1 28.8,40.7 C19.1 29.02,40.35 U$1.44 | U$1.34 31.45,45.65 31.29,45.81 v30.96,45.81 v30.95,45.82 30.34,45.82 C22.1 C18.1 R1.P$2 28.7,45.84 FB.P$2 | U$1.22 36.78,42.99 38.26,42.99 38.44,43.18 C20.1 38.7,39.49 v38.9,39.3 38.88,39.3 C21.1 37.78,38.35 U$1.13
  Bottom 0.152: v38.9,39.3 30.6,39.3 30.13,39.77 28.5,39.77 27.13,41.14 | 27.13,41.14 26.87,41.4 26.87,42.53 27.55,43.21 28.4,43.21 28.4,44.66 29.25,45.51 30.21,45.51 30.51,45.81 v30.96,45.81 | v28.4,41.2 28.34,41.14 27.13,41.14
X32_Q1
  Top 0.152: U$1.4 31.95,37.02 34.5,34.47 34.5,33.2 35.31,32.39 Y2.Q1 C2.1
X32_Q2
  Top 0.152: U$1.5 32.45,36.95 34.51,34.89 Y2.Q2 C4.1
X_48_Q1
  Top 0.152: U$1.46 29.36,39.35 28.71,38.7 24.03,38.7 Y1.Q2
X_48_Q2
  Top 0.152: U$1.47 29.3,38.85 28.85,38.4 25,38.4 24.43,37.82 Y1.Q1

### Text on the board
tPlace: Learning Particle | v2.1 August 2020